# Altium schematic sheet CAR PCB.SchDoc
size 297 x 209 mm
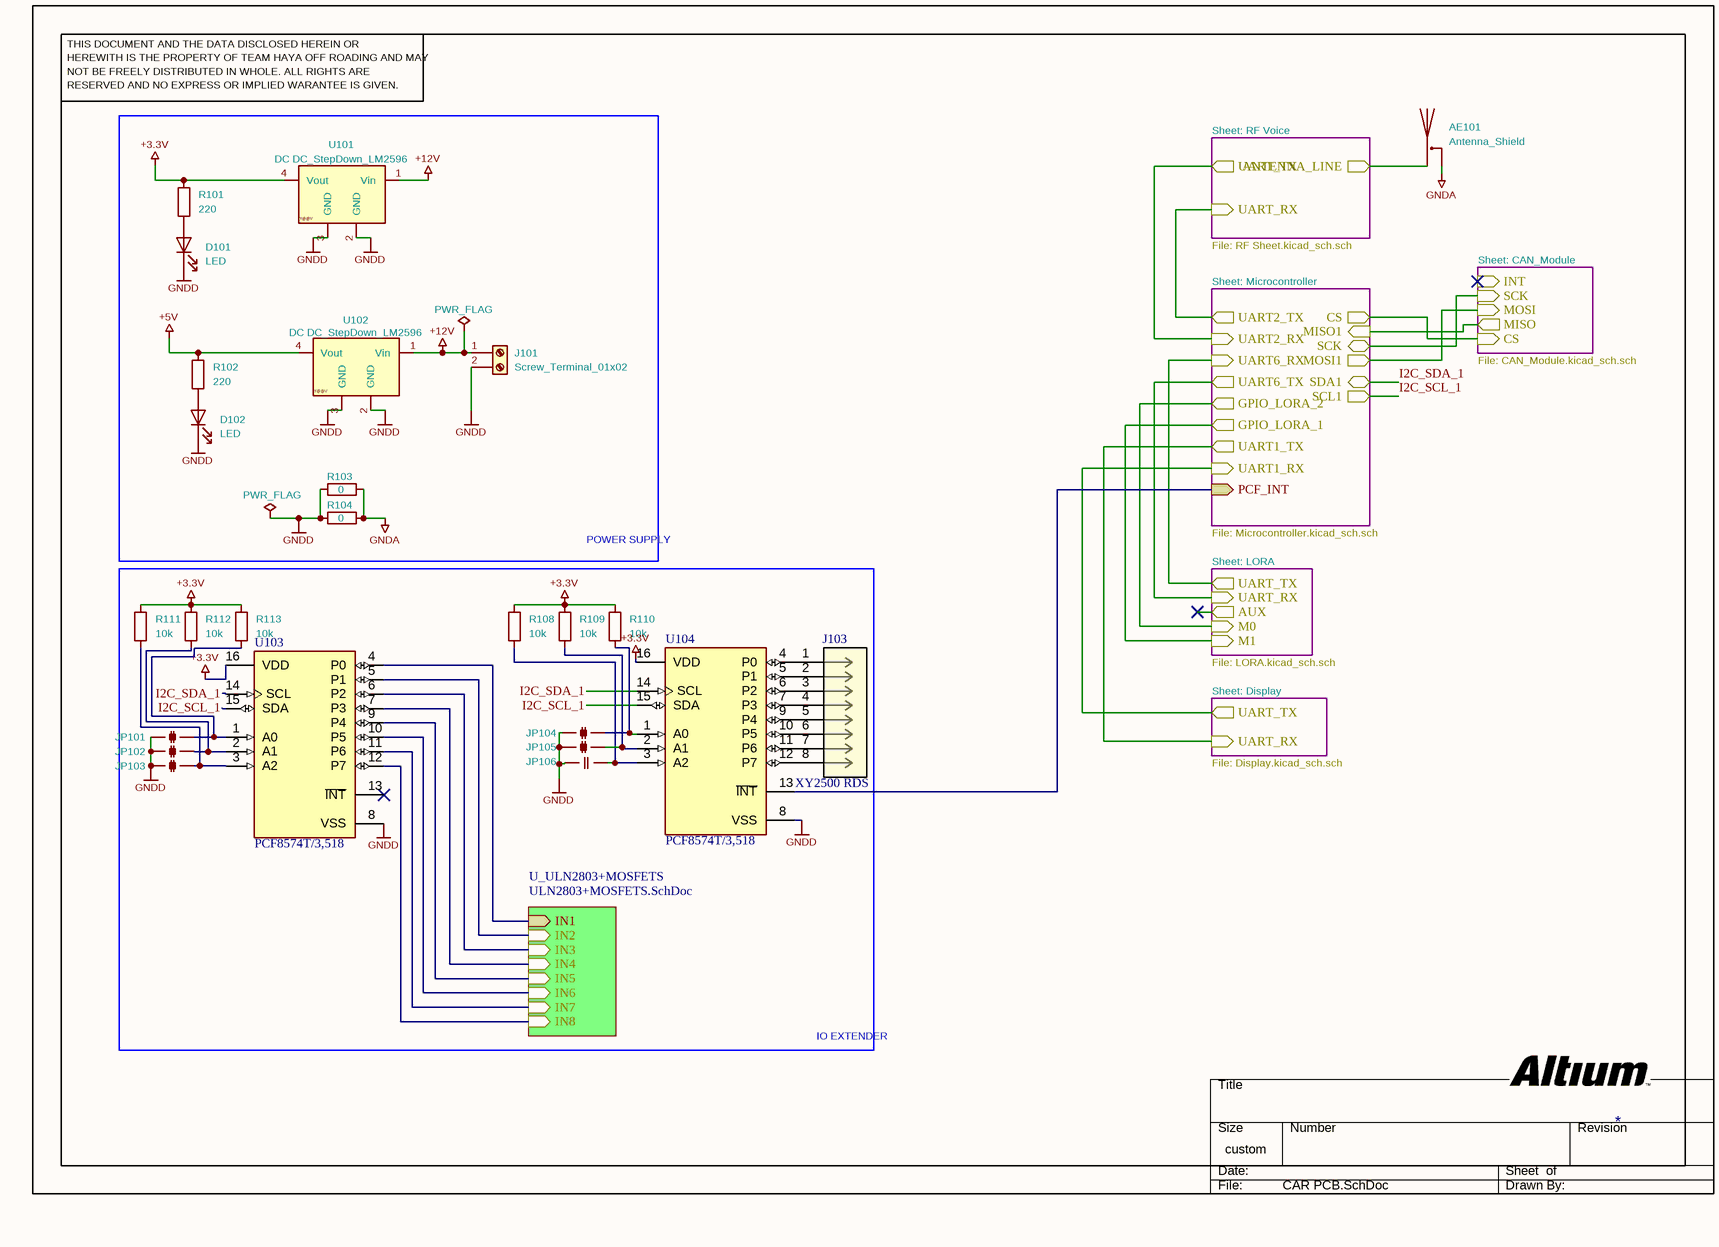
[diagram p0: CAR PCB.SchDoc]

## Parts
#FLG0102  PWR_FLAG  (graphical)
#FLG0103  PWR_FLAG  (graphical)
AE101  Antenna_Shield  [132134_AMP]
D101  LED  [LED_1206_3216Metric_Pad1.42x1.75mm_HandSolder]
D102  LED  [LED_1206_3216Metric_Pad1.42x1.75mm_HandSolder]
J101  Screw_Terminal_01x02  [TerminalBlock_Phoenix_MKDS-3-2-5.08_1x02_P5.08mm_Horizontal]
J103  XY2500 RDS  [TerminalBlock_Phoenix_MKDS-1,5-8-5.08_1x08_P5.08mm_Horizontal]
JP101  SolderJumper_2_Bridged  [R_0603_1608Metric_Pad0.98x0.95mm_HandSolder]  (value not drawn)
JP102  SolderJumper_2_Bridged  [R_0603_1608Metric_Pad0.98x0.95mm_HandSolder]  (value not drawn)
JP103  SolderJumper_2_Bridged  [R_0603_1608Metric_Pad0.98x0.95mm_HandSolder]  (value not drawn)
JP104  SolderJumper_2_Bridged  [R_0603_1608Metric_Pad0.98x0.95mm_HandSolder]  (value not drawn)
JP105  SolderJumper_2_Bridged  [R_0603_1608Metric_Pad0.98x0.95mm_HandSolder]  (value not drawn)
JP106  SolderJumper_2_Open  [R_0603_1608Metric_Pad0.98x0.95mm_HandSolder]  (value not drawn)
R101  220  [R_0805_2012Metric_Pad1.20x1.40mm_HandSolder]
R102  220  [R_0805_2012Metric_Pad1.20x1.40mm_HandSolder]
R103  0  [R_1206_3216Metric_Pad1.30x1.75mm_HandSolder]
R104  0  [R_1206_3216Metric_Pad1.30x1.75mm_HandSolder]
R108  10k  [R_1206_3216Metric_Pad1.30x1.75mm_HandSolder]
R109  value 10k  [R_1206_3216Metric_Pad1.30x1.75mm_HandSolder]  (hidden comment: 1k)
R110  value 10k  [R_1206_3216Metric_Pad1.30x1.75mm_HandSolder]  (hidden comment: 1k)
R111  value 10k  [R_1206_3216Metric_Pad1.30x1.75mm_HandSolder]  (hidden comment: 1k)
R112  value 10k  [R_1206_3216Metric_Pad1.30x1.75mm_HandSolder]  (hidden comment: 1k)
R113  value 10k  [R_1206_3216Metric_Pad1.30x1.75mm_HandSolder]  (hidden comment: 1k)
U101  DC DC_StepDown_LM2596  [YAAJ_DCDC_StepDown_LM2596]
U102  DC DC_StepDown_LM2596  [YAAJ_DCDC_StepDown_LM2596]
U103  PCF8574T/3,518  [FP-SOT162-1-MFG]
U104  PCF8574T/3,518  [FP-SOT162-1-MFG]

## Blocks framed on the sheet
POWER SUPPLY: #FLG0102 #FLG0103 D101 D102 J101 R101-R104 U101 U102
IO EXTENDER: J103 JP101-JP106 R108-R113 U103 U104

## Sub-sheets
CAN_Module = CAN_Module.SchDoc: INT (in), SCK (in), MOSI (in), MISO (out), CS (in)
Display = Display.SchDoc: UART_TX (out), UART_RX (in)
LORA = LORA.SchDoc: AUX (out), UART_RX (in), UART_TX (out), M0 (in), M1 (in)
Microcontroller = Microcontroller.SchDoc: UART2_TX (out), UART2_RX (in), UART6_RX (in), UART6_TX (out), GPIO_LORA_2 (out), GPIO_LORA_1 (out), UART1_TX (out), UART1_RX (in), CS (out), MISO1 (in), SCK (bidir), MOSI1 (out), SDA1 (bidir), SCL1 (out), PCF_INT (in)
RF Voice = RF Sheet.SchDoc: UART_TX (out), UART_RX (in), ANTENNA_LINE (out)
U_ULN2803+MOSFETS = ULN2803+MOSFETS.SchDoc: IN3 (in), IN5 (in), IN2 (in), IN6 (in), IN8 (in), IN4 (in), IN7 (in), IN1 (in)

## Nets
+3.3V: R101.1 R108.1 R109.1 R110.1 R111.1 R112.1 R113.1 U101.4(Vout) U103.16(VDD) U104.16(VDD)
+5V: R102.1 U102.4(Vout)
+12V: #FLG0103.1 J101.1(Pin_1) U101.1(Vin) U102.1(Vin)
GNDA: AE101.2(Shield) R103.2 R104.2
GNDD: #FLG0102.1 D101.1(K) D102.1(K) J101.2(Pin_2) JP101.1(A) JP102.1(A) JP103.1(A) JP104.1(A) JP105.1(A) JP106.1(A) R103.1 R104.1 U101.2(GND) U101.3(GND) U102.2(GND) U102.3(GND) U103.8(VSS) U104.8(VSS)
I2C_SCL_1: U103.15(SDA) U104.15(SDA) ; sheet Microcontroller/SCL1
I2C_SDA_1: U103.14(SCL) U104.14(SCL) ; sheet Microcontroller/SDA1
NetAE101_1: AE101.1(A) ; sheet RF Voice/ANTENNA_LINE
NetD101_2: D101.2(A) R101.2
NetD102_2: D102.2(A) R102.2
NetJ103_1: J103.1 U104.4(P0)
NetJ103_2: J103.2 U104.5(P1)
NetJ103_3: J103.3 U104.6(P2)
NetJ103_4: J103.4 U104.7(P3)
NetJ103_5: J103.5 U104.9(P4)
NetJ103_6: J103.6 U104.10(P5)
NetJ103_7: J103.7 U104.11(P6)
NetJ103_8: J103.8 U104.12(P7)
NetJP101_2: JP101.2(B) R113.2 U103.1(A0)
NetJP102_2: JP102.2(B) R112.2 U103.2(A1)
NetJP103_2: JP103.2(B) R111.2 U103.3(A2)
NetJP104_2: JP104.2(B) R110.2 U104.1(A0)
NetJP105_2: JP105.2(B) R109.2 U104.2(A1)
NetJP106_2: JP106.2(B) R108.2 U104.3(A2)
NetU103_4: U103.4(P0) ; sheet U_ULN2803+MOSFETS/IN1
NetU103_5: U103.5(P1) ; sheet U_ULN2803+MOSFETS/IN2
NetU103_6: U103.6(P2) ; sheet U_ULN2803+MOSFETS/IN3
NetU103_7: U103.7(P3) ; sheet U_ULN2803+MOSFETS/IN4
NetU103_9: U103.9(P4) ; sheet U_ULN2803+MOSFETS/IN5
NetU103_10: U103.10(P5) ; sheet U_ULN2803+MOSFETS/IN6
NetU103_11: U103.11(P6) ; sheet U_ULN2803+MOSFETS/IN7
NetU103_12: U103.12(P7) ; sheet U_ULN2803+MOSFETS/IN8
NetU104_13: U104.13(~{INT}) ; sheet Microcontroller/PCF_INT
(unnamed): sheet Display/UART_TX, sheet Microcontroller/UART1_RX
(unnamed): sheet Display/UART_RX, sheet Microcontroller/UART1_TX
(unnamed): sheet RF Voice/UART_TX, sheet Microcontroller/UART2_RX
(unnamed): sheet RF Voice/UART_RX, sheet Microcontroller/UART2_TX
(unnamed): sheet CAN_Module/SCK, sheet Microcontroller/SCK
(unnamed): sheet CAN_Module/MOSI, sheet Microcontroller/MOSI1
(unnamed): sheet CAN_Module/MISO, sheet Microcontroller/MISO1
(unnamed): sheet CAN_Module/CS, sheet Microcontroller/CS
(unnamed): sheet LORA/UART_RX, sheet Microcontroller/UART6_TX
(unnamed): sheet LORA/UART_TX, sheet Microcontroller/UART6_RX
(unnamed): sheet LORA/M0, sheet Microcontroller/GPIO_LORA_2
(unnamed): sheet LORA/M1, sheet Microcontroller/GPIO_LORA_1

Not connected (* = marked no-connect by the designer): U103 13(~{INT})*

## Notes on the sheet
- Sheet: RF Voice
- File: RF Sheet.kicad_sch.sch
- Sheet: Microcontroller
- Sheet: CAN_Module
- File: CAN_Module.kicad_sch.sch
- Sheet: LORA
- File: Microcontroller.kicad_sch.sch
- File: LORA.kicad_sch.sch
- Sheet: Display
- File: Display.kicad_sch.sch
- THIS DOCUMENT AND THE DATA DISCLOSED HEREIN OR
- HEREWITH IS THE PROPERTY OF TEAM HAYA OFF ROADING AND MAY
- NOT BE FREELY DISTRIBUTED IN WHOLE. ALL RIGHTS ARE
- RESERVED AND NO EXPRESS OR IMPLIED WARANTEE IS GIVEN.
- (in symbol DCDC_StepDown_LM2596) Y@@V

## Library data of the parts
J103 = 796867-8: No Description Available; Mfr_Name: TE Connectivity; TYPE: Header; RefDes: RefDes
R101-R104 R108-R113 = R
  R101 R102: Value: 220; Footprint: Resistor_SMD:R_0805_2012Metric_Pad1.20x1.40mm_HandSolder
  R103 R104: Value: 0; Footprint: Resistor_SMD:R_1206_3216Metric_Pad1.30x1.75mm_HandSolder
  R108: Value: 10k; Footprint: Resistor_SMD:R_1206_3216Metric_Pad1.30x1.75mm_HandSolder
  R109-R113: Footprint: Resistor_SMD:R_1206_3216Metric_Pad1.30x1.75mm_HandSolder
U101 U102 = DCDC_StepDown_LM2596: Value: DC DC_StepDown_LM2596; Footprint: DC DC Modules:DCDC_StepDown_LM2596
U103 U104 = CMP-10112-000010-1: IC I/O EXPANDER I2C 8B 16SOIC; Manufacturer: NXP Semiconductors; Frequency: 100kHz; Max Supply Voltage: 6V; Standoff Height: 0.1mm; Nominal Supply Current: 40uA; Max Junction Temp: +125°C; Min Supply Voltage: 2.5V; Number Of I/Os: 8; Manufacturer Part Number: PCF8574T/3,518; Footprint Url: https://www.nxp.com/docs/en/package-information/SOT162-1.pdf; ComponentLink2URL: https://www.nxp.com/docs/en/data-sheet/PCF8574_PCF8574A.pdf; Automotive: No; Digikey Description: IC I/O EXPANDER I2C 8B 16SOIC; Mouser Description: PCF8574 Series 2.5 - 6V Remote 8-bit I/O Expander for I2C-bus - SOIC-16; Ipc Land Pattern Name: SOIC127P1032X265-16; Interface: I2C; Octopart: https://octopart.com/pcf8574t%2F3%2C518-nxp+semiconductors-10470852; Ambient Temperature Range Low: -40°C; Lead Free: Yes; Device Class L2: Interface ICs; Temperature Range High: +85°C; Device Class L1: Integrated Circuits (ICs); Package: SOT162-1; ComponentLink2Description: Datasheet; Device Class L3: I/O Expanders; Temperature: -40°C to +85°C; Ambient Temperature Range High: +85°C; Height: 2.65mm; Category: IC; RoHS: TRUE; Temperature Range Low: -40°C
#FLG0102 #FLG0103 = PWR_FLAG: Value: PWR_FLAG
AE101 = Antenna_Shield: Value: Antenna_Shield; Footprint: Connector_Coaxial:SMA_Amphenol_132134-11_Vertical
D101 D102 = LED: Value: LED; Footprint: LED_SMD:LED_1206_3216Metric_Pad1.42x1.75mm_HandSolder
J101 = Screw_Terminal_01x02: Value: Screw_Terminal_01x02; Footprint: TerminalBlock_Phoenix:TerminalBlock_Phoenix_MKDS-3-2-5.08_1x02_P5.08mm_Horizontal
JP101-JP105 = SolderJumper_2_Bridged: Value: SolderJumper_2_Bridged
JP106 = SolderJumper_2_Open: Value: SolderJumper_2_Open